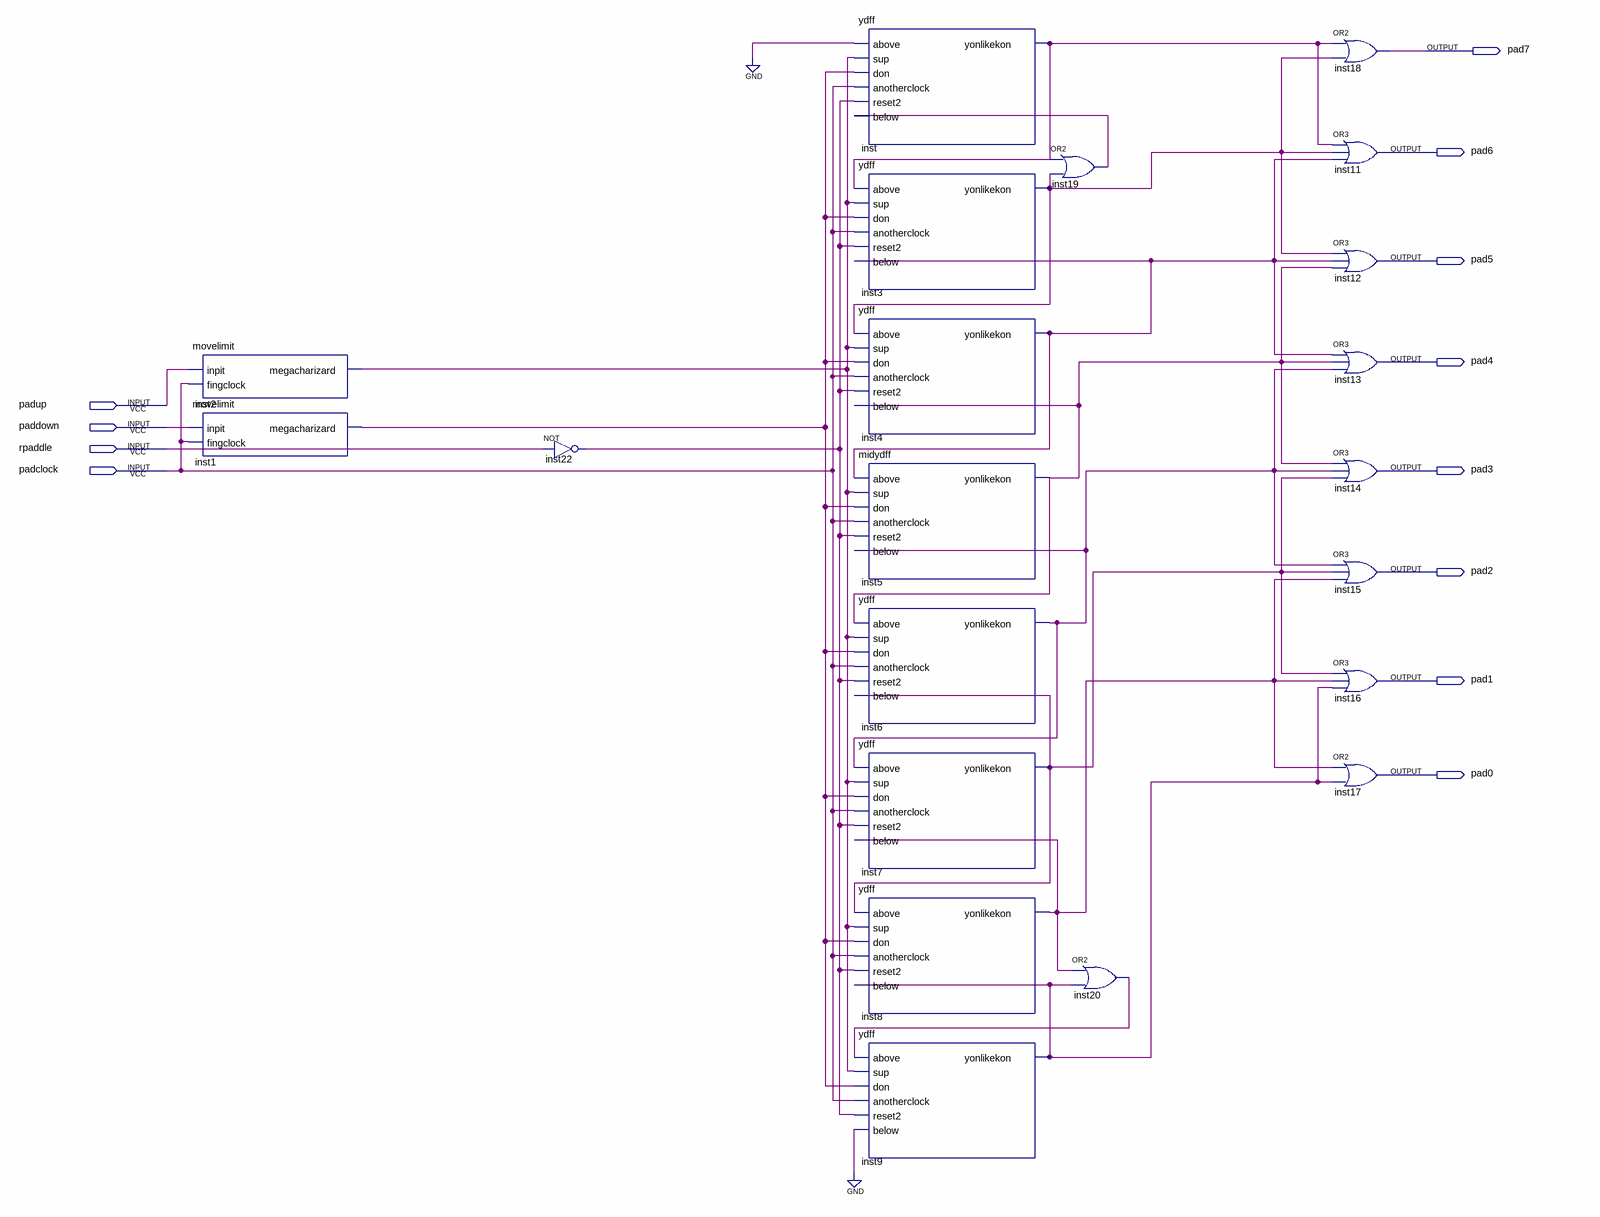
[diagram p0: schematic sheet]
// Quartus schematic paddleloc.bdf as structural Verilog: 21 symbols, 12 pins
module paddleloc (
  input  padup,
  input  paddown,
  input  rpaddle,
  input  padclock,
  output pad7,
  output pad6,
  output pad5,
  output pad4,
  output pad3,
  output pad2,
  output pad1,
  output pad0
);

  wire inst1_megacharizard, inst2_megacharizard, inst3_yonlikekon, inst4_yonlikekon, inst5_yonlikekon,
       inst6_yonlikekon, inst7_yonlikekon, inst8_yonlikekon, inst9_yonlikekon, inst19_out, inst20_out,
       inst22_out, inst_yonlikekon;

  movelimit inst2 (.inpit(padup), .fingclock(padclock), .megacharizard(inst2_megacharizard));
  movelimit inst1 (.inpit(paddown), .fingclock(padclock), .megacharizard(inst1_megacharizard));
  not inst22 (inst22_out, rpaddle);
  ydff inst (
    .above(1'b0), .sup(inst2_megacharizard), .don(inst1_megacharizard), .anotherclock(padclock),
    .reset2(inst22_out), .below(inst19_out), .yonlikekon(inst_yonlikekon));
  ydff inst3 (
    .above(inst_yonlikekon), .sup(inst2_megacharizard), .don(inst1_megacharizard), .anotherclock(padclock),
    .reset2(inst22_out), .below(inst4_yonlikekon), .yonlikekon(inst3_yonlikekon));
  ydff inst4 (
    .above(inst3_yonlikekon), .sup(inst2_megacharizard), .don(inst1_megacharizard), .anotherclock(padclock),
    .reset2(inst22_out), .below(inst5_yonlikekon), .yonlikekon(inst4_yonlikekon));
  midydff inst5 (
    .above(inst4_yonlikekon), .sup(inst2_megacharizard), .don(inst1_megacharizard), .anotherclock(padclock),
    .reset2(inst22_out), .below(inst6_yonlikekon), .yonlikekon(inst5_yonlikekon));
  ydff inst6 (
    .above(inst5_yonlikekon), .sup(inst2_megacharizard), .don(inst1_megacharizard), .anotherclock(padclock),
    .reset2(inst22_out), .below(inst7_yonlikekon), .yonlikekon(inst6_yonlikekon));
  ydff inst7 (
    .above(inst6_yonlikekon), .sup(inst2_megacharizard), .don(inst1_megacharizard), .anotherclock(padclock),
    .reset2(inst22_out), .below(inst8_yonlikekon), .yonlikekon(inst7_yonlikekon));
  ydff inst8 (
    .above(inst7_yonlikekon), .sup(inst2_megacharizard), .don(inst1_megacharizard), .anotherclock(padclock),
    .reset2(inst22_out), .below(inst9_yonlikekon), .yonlikekon(inst8_yonlikekon));
  ydff inst9 (
    .above(inst20_out), .sup(inst2_megacharizard), .don(inst1_megacharizard), .anotherclock(padclock),
    .reset2(inst22_out), .below(1'b0), .yonlikekon(inst9_yonlikekon));
  or inst19 (inst19_out, inst_yonlikekon, inst3_yonlikekon);
  or inst20 (inst20_out, inst8_yonlikekon, inst9_yonlikekon);
  or inst18 (pad7, inst_yonlikekon, inst3_yonlikekon);
  or inst11 (pad6, inst_yonlikekon, inst3_yonlikekon, inst4_yonlikekon);
  or inst12 (pad5, inst3_yonlikekon, inst4_yonlikekon, inst5_yonlikekon);
  or inst13 (pad4, inst4_yonlikekon, inst5_yonlikekon, inst6_yonlikekon);
  or inst14 (pad3, inst5_yonlikekon, inst6_yonlikekon, inst7_yonlikekon);
  or inst15 (pad2, inst6_yonlikekon, inst7_yonlikekon, inst8_yonlikekon);
  or inst16 (pad1, inst7_yonlikekon, inst8_yonlikekon, inst9_yonlikekon);
  or inst17 (pad0, inst8_yonlikekon, inst9_yonlikekon);
endmodule
